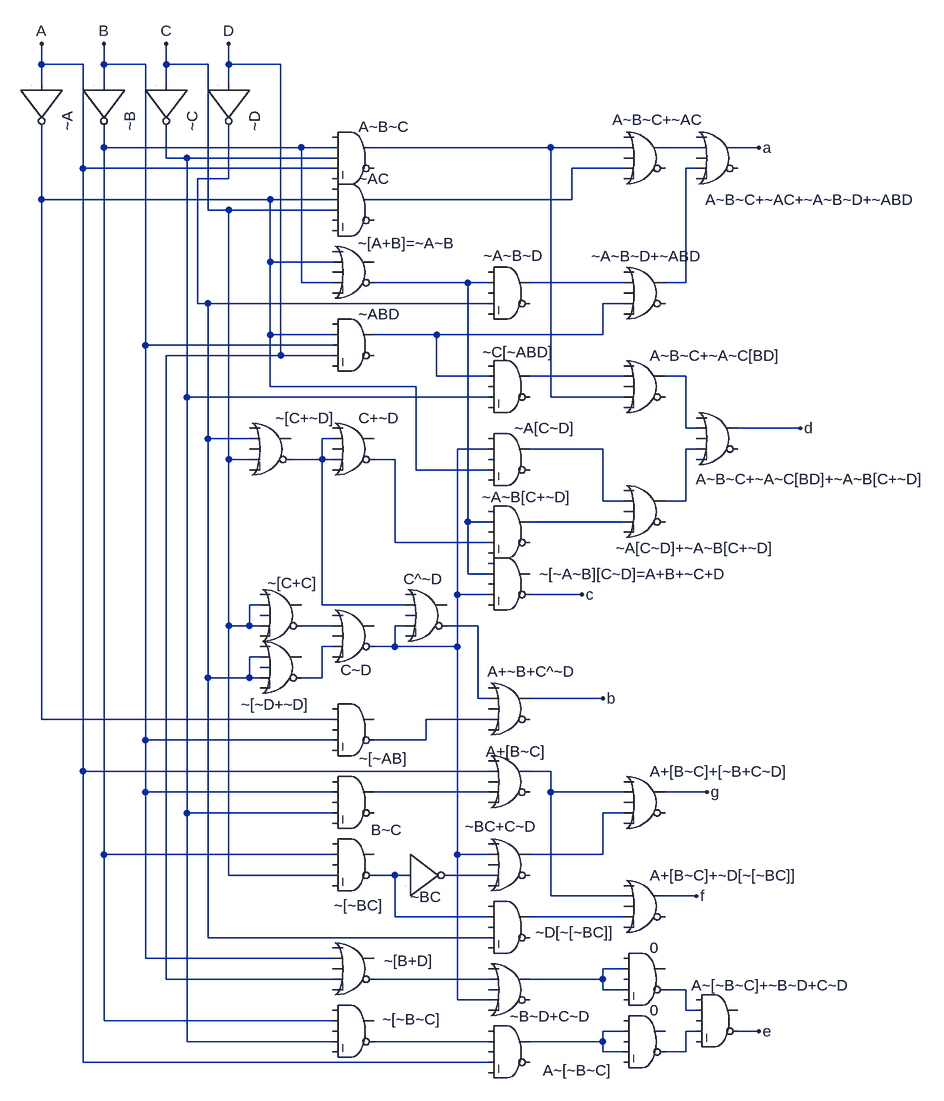
[diagram p0: schematic draft.asc]
draft.asc, the LTspice schematic file:
Version 4
SHEET 1 880 2072
WIRE -1280 -1504 -1280 -1536
WIRE -1216 -1504 -1280 -1504
WIRE -1184 -1504 -1184 -1536
WIRE -1120 -1504 -1184 -1504
WIRE -1088 -1504 -1088 -1536
WIRE -1024 -1504 -1088 -1504
WIRE -992 -1504 -992 -1536
WIRE -912 -1504 -992 -1504
WIRE -1280 -1472 -1280 -1504
WIRE -1184 -1472 -1184 -1504
WIRE -1088 -1472 -1088 -1504
WIRE -992 -1472 -992 -1504
WIRE -1184 -1376 -1184 -1408
WIRE -880 -1376 -1184 -1376
WIRE -832 -1376 -880 -1376
WIRE -496 -1376 -768 -1376
WIRE -384 -1376 -496 -1376
WIRE -272 -1376 -320 -1376
WIRE -176 -1376 -208 -1376
WIRE -1088 -1360 -1088 -1408
WIRE -1056 -1360 -1088 -1360
WIRE -832 -1360 -1056 -1360
WIRE -1216 -1344 -1216 -1504
WIRE -832 -1344 -1216 -1344
WIRE -384 -1344 -464 -1344
WIRE -272 -1344 -288 -1344
WIRE -992 -1328 -992 -1408
WIRE -992 -1328 -1040 -1328
WIRE -1280 -1296 -1280 -1408
WIRE -928 -1296 -1280 -1296
WIRE -832 -1296 -928 -1296
WIRE -464 -1296 -464 -1344
WIRE -464 -1296 -768 -1296
WIRE -1024 -1280 -1024 -1504
WIRE -992 -1280 -1024 -1280
WIRE -832 -1280 -992 -1280
WIRE -928 -1200 -928 -1296
WIRE -832 -1200 -928 -1200
WIRE -880 -1168 -880 -1376
WIRE -832 -1168 -880 -1168
WIRE -624 -1168 -768 -1168
WIRE -592 -1168 -624 -1168
WIRE -384 -1168 -528 -1168
WIRE -288 -1168 -288 -1344
WIRE -288 -1168 -320 -1168
WIRE -1040 -1136 -1040 -1328
WIRE -1024 -1136 -1040 -1136
WIRE -592 -1136 -1024 -1136
WIRE -384 -1136 -416 -1136
WIRE -928 -1088 -928 -1200
WIRE -832 -1088 -928 -1088
WIRE -672 -1088 -768 -1088
WIRE -416 -1088 -416 -1136
WIRE -416 -1088 -672 -1088
WIRE -1120 -1072 -1120 -1504
WIRE -832 -1072 -1120 -1072
WIRE -912 -1056 -912 -1504
WIRE -912 -1056 -1088 -1056
WIRE -832 -1056 -912 -1056
WIRE -672 -1024 -672 -1088
WIRE -592 -1024 -672 -1024
WIRE -384 -1024 -528 -1024
WIRE -288 -1024 -320 -1024
WIRE -928 -1008 -928 -1088
WIRE -704 -1008 -928 -1008
WIRE -1056 -992 -1056 -1360
WIRE -592 -992 -1056 -992
WIRE -496 -992 -496 -1376
WIRE -384 -992 -496 -992
WIRE -288 -944 -288 -1024
WIRE -272 -944 -288 -944
WIRE -112 -944 -208 -944
WIRE -1024 -928 -1024 -1136
WIRE -960 -928 -1024 -928
WIRE -832 -928 -848 -928
WIRE -592 -912 -640 -912
WIRE -416 -912 -528 -912
WIRE -272 -912 -288 -912
WIRE -992 -896 -992 -1280
WIRE -960 -896 -992 -896
WIRE -848 -896 -848 -928
WIRE -848 -896 -896 -896
WIRE -832 -896 -848 -896
WIRE -736 -896 -768 -896
WIRE -704 -880 -704 -1008
WIRE -592 -880 -704 -880
WIRE -416 -832 -416 -912
WIRE -384 -832 -416 -832
WIRE -288 -832 -288 -912
WIRE -288 -832 -320 -832
WIRE -624 -800 -624 -1168
WIRE -592 -800 -624 -800
WIRE -384 -800 -528 -800
WIRE -736 -768 -736 -896
WIRE -592 -768 -736 -768
WIRE -624 -720 -624 -800
WIRE -592 -720 -624 -720
WIRE -640 -688 -640 -912
WIRE -592 -688 -640 -688
WIRE -448 -688 -528 -688
WIRE -944 -672 -960 -672
WIRE -848 -672 -848 -896
WIRE -720 -672 -848 -672
WIRE -992 -640 -992 -896
WIRE -960 -640 -960 -672
WIRE -960 -640 -992 -640
WIRE -944 -640 -960 -640
WIRE -832 -640 -880 -640
WIRE -720 -640 -736 -640
WIRE -608 -640 -656 -640
WIRE -832 -608 -848 -608
WIRE -736 -608 -736 -640
WIRE -736 -608 -768 -608
WIRE -640 -608 -640 -688
WIRE -640 -608 -736 -608
WIRE -944 -592 -960 -592
WIRE -1024 -560 -1024 -928
WIRE -960 -560 -960 -592
WIRE -960 -560 -1024 -560
WIRE -944 -560 -960 -560
WIRE -848 -560 -848 -608
WIRE -848 -560 -880 -560
WIRE -608 -528 -608 -640
WIRE -592 -528 -608 -528
WIRE -416 -528 -528 -528
WIRE -1280 -496 -1280 -1296
WIRE -832 -496 -1280 -496
WIRE -592 -496 -688 -496
WIRE -1120 -464 -1120 -1072
WIRE -832 -464 -1120 -464
WIRE -688 -464 -688 -496
WIRE -688 -464 -768 -464
WIRE -1216 -416 -1216 -1344
WIRE -592 -416 -1216 -416
WIRE -496 -416 -528 -416
WIRE -1120 -384 -1120 -464
WIRE -832 -384 -1120 -384
WIRE -592 -384 -768 -384
WIRE -496 -384 -496 -416
WIRE -384 -384 -496 -384
WIRE -256 -384 -320 -384
WIRE -1056 -352 -1056 -992
WIRE -832 -352 -1056 -352
WIRE -384 -352 -416 -352
WIRE -1184 -288 -1184 -1376
WIRE -832 -288 -1184 -288
WIRE -640 -288 -640 -608
WIRE -592 -288 -640 -288
WIRE -416 -288 -416 -352
WIRE -416 -288 -528 -288
WIRE -992 -256 -992 -640
WIRE -832 -256 -992 -256
WIRE -736 -256 -768 -256
WIRE -720 -256 -736 -256
WIRE -592 -256 -656 -256
WIRE -496 -224 -496 -384
WIRE -384 -224 -496 -224
WIRE -272 -224 -320 -224
WIRE -736 -192 -736 -256
WIRE -592 -192 -736 -192
WIRE -384 -192 -528 -192
WIRE -1024 -160 -1024 -560
WIRE -592 -160 -1024 -160
WIRE -1120 -128 -1120 -384
WIRE -832 -128 -1120 -128
WIRE -384 -112 -416 -112
WIRE -1088 -96 -1088 -1056
WIRE -832 -96 -1088 -96
WIRE -592 -96 -768 -96
WIRE -416 -96 -416 -112
WIRE -416 -96 -528 -96
WIRE -416 -80 -416 -96
WIRE -384 -80 -416 -80
WIRE -288 -80 -320 -80
WIRE -640 -64 -640 -288
WIRE -592 -64 -640 -64
WIRE -288 -48 -288 -80
WIRE -272 -48 -288 -48
WIRE -1184 -32 -1184 -288
WIRE -832 -32 -1184 -32
WIRE -384 -16 -416 -16
WIRE -272 -16 -288 -16
WIRE -176 -16 -208 -16
WIRE -1056 0 -1056 -352
WIRE -832 0 -1056 0
WIRE -592 0 -768 0
WIRE -416 0 -416 -16
WIRE -416 0 -528 0
WIRE -416 16 -416 0
WIRE -384 16 -416 16
WIRE -288 16 -288 -16
WIRE -288 16 -320 16
WIRE -1216 32 -1216 -416
WIRE -592 32 -1216 32
FLAG -1280 -1536 A
FLAG -1184 -1536 B
FLAG -1088 -1536 C
FLAG -992 -1536 D
FLAG -176 -1376 a
FLAG -112 -944 d
FLAG -448 -688 c
FLAG -416 -528 b
FLAG -256 -384 g
FLAG -272 -224 f
FLAG -176 -16 e
SYMBOL Digital\\and -800 -1344 R0
SYMATTR InstName ~AC
SYMBOL Digital\\and -800 -1136 R0
SYMATTR InstName ~ABD
SYMBOL Digital\\inv -1024 -1472 R90
SYMATTR InstName ~C
SYMBOL Digital\\inv -1216 -1472 R90
SYMATTR InstName ~A
SYMBOL Digital\\inv -1120 -1472 R90
SYMATTR InstName ~B
SYMBOL Digital\\inv -928 -1472 R90
SYMATTR InstName ~D
SYMBOL Digital\\and -800 -1424 R0
SYMATTR InstName A~B~C
SYMBOL Digital\\and -560 -1216 R0
WINDOW 0 -40 6 Left 2
SYMATTR InstName ~A~B~D
SYMBOL Digital\\and -560 -1072 R0
WINDOW 0 -41 11 Left 2
SYMATTR InstName ~C[~ABD]
SYMBOL Digital\\or -352 -1424 R0
WINDOW 0 -49 5 Left 2
SYMATTR InstName A~B~C+~AC
SYMBOL Digital\\or -352 -1216 R0
WINDOW 0 -82 7 Left 2
SYMATTR InstName ~A~B~D+~ABD
SYMBOL Digital\\or -240 -1424 R0
WINDOW 0 -18 128 Left 2
SYMATTR InstName A~B~C+~AC+~A~B~D+~ABD
SYMBOL Digital\\and -560 -960 R0
SYMATTR InstName ~A[C~D]
SYMBOL Digital\\or -928 -976 R0
SYMATTR InstName ~[C+~D]
SYMBOL Digital\\and -560 -848 R0
WINDOW 0 -42 10 Left 2
SYMATTR InstName ~A~B[C+~D]
SYMBOL Digital\\or -352 -1072 R0
SYMATTR InstName A~B~C+~A~C[BD]
SYMBOL Digital\\or -352 -880 R0
WINDOW 0 -44 120 Left 2
SYMATTR InstName ~A[C~D]+~A~B[C+~D]
SYMBOL Digital\\or -240 -992 R0
WINDOW 0 -33 126 Left 2
SYMATTR InstName A~B~C+~A~C[BD]+~A~B[C+~D]
SYMBOL Digital\\or -800 -1248 R0
WINDOW 0 7 19 Left 2
SYMATTR InstName ~[A+B]=~A~B
SYMBOL Digital\\and -560 -768 R0
WINDOW 0 46 48 Left 2
SYMATTR InstName ~[~A~B][C~D]=A+B+~C+D
SYMBOL Digital\\or -560 -576 R0
WINDOW 0 -34 6 Left 2
SYMATTR InstName A+~B+C^~D
SYMBOL Digital\\and -800 -544 R0
WINDOW 0 9 108 Left 2
SYMATTR InstName ~[~AB]
SYMBOL Digital\\or -560 -464 R0
WINDOW 0 -36 17 Left 2
SYMATTR InstName A+[B~C]
SYMBOL Digital\\or -352 -432 R0
SYMATTR InstName A+[B~C]+[~B+C~D]
SYMBOL Digital\\and -800 -432 R0
WINDOW 0 27 106 Left 2
SYMATTR InstName B~C
SYMBOL Digital\\and -800 -336 R0
WINDOW 0 -30 126 Left 2
SYMATTR InstName ~[~BC]
SYMBOL Digital\\or -560 -336 R0
WINDOW 0 -68 5 Left 2
SYMATTR InstName ~BC+C~D
SYMBOL Digital\\and -560 -240 R0
WINDOW 0 40 72 Left 2
SYMATTR InstName ~D[~[~BC]]
SYMBOL Digital\\inv -720 -320 R0
WINDOW 0 8 97 Left 2
SYMATTR InstName ~BC
SYMBOL Digital\\or -352 -272 R0
SYMATTR InstName A+[B~C]+~D[~[~BC]]
SYMBOL Digital\\or -800 -976 R0
SYMATTR InstName C+~D
SYMBOL Digital\\or -688 -720 R0
WINDOW 0 -35 8 Left 2
SYMATTR InstName C^~D
SYMBOL Digital\\or -912 -720 R0
WINDOW 0 -20 14 Left 2
SYMATTR InstName ~[C+C]
SYMBOL Digital\\or -912 -640 R0
WINDOW 0 -61 121 Left 2
SYMATTR InstName ~[~D+~D]
SYMBOL Digital\\or -800 -688 R0
WINDOW 0 -20 116 Left 2
SYMATTR InstName C~D
SYMBOL Digital\\or -800 -176 R0
WINDOW 0 47 52 Left 2
SYMATTR InstName ~[B+D]
SYMBOL Digital\\or -560 -144 R0
WINDOW 0 1 105 Left 2
SYMATTR InstName ~B~D+C~D
SYMBOL Digital\\and -800 -80 R0
WINDOW 0 45 46 Left 2
SYMATTR InstName ~[~B~C]
SYMBOL Digital\\and -560 -48 R0
WINDOW 0 52 92 Left 2
SYMATTR InstName A~[~B~C]
SYMBOL Digital\\and -352 -64 R0
SYMATTR InstName 0
SYMBOL Digital\\and -352 -160 R0
SYMATTR InstName 0
SYMBOL Digital\\and -240 -96 R0
WINDOW 0 -40 9 Left 2
SYMATTR InstName A~[~B~C]+~B~D+C~D

The netlist it stands for:
* draft.asc
A§~AC 0 N008 C 0 0 0 N005 0 AND
A§~ABD 0 N008 B D 0 0 N011 0 AND
A§~C C 0 0 0 0 N004 0 0 BUF
A§~A A 0 0 0 0 N008 0 0 BUF
A§~B B 0 0 0 0 N001 0 0 BUF
A§~D D 0 0 0 0 N007 0 0 BUF
A~B~C 0 N001 N004 A 0 0 N002 0 AND
A§~A~B~D 0 N009 0 N007 0 0 N010 0 AND
A§~C[~ABD] 0 N011 0 N004 0 0 N012 0 AND
A~B~C+~AC 0 N002 0 N005 0 0 N003 0 OR
A§~A~B~D+~ABD 0 N010 0 N011 0 0 N006 0 OR
A~B~C+~AC+~A~B~D+~ABD 0 N003 0 N006 0 0 A 0 OR
A§~A[C~D] 0 N015 0 N008 0 0 N016 0 AND
A§~[C+~D] 0 N007 0 C 0 N014 0 0 OR
A§~A~B[C+~D] 0 N009 0 N018 0 0 N019 0 AND
A~B~C+~A~C[BD] 0 N012 0 N002 0 0 N013 0 OR
A§~A[C~D]+~A~B[C+~D] 0 N016 0 N019 0 0 N017 0 OR
A~B~C+~A~C[BD]+~A~B[C+~D] 0 N013 0 N017 0 0 D 0 OR
A§~[A+B]=~A~B 0 N008 0 N001 0 N009 0 0 OR
A§~[~A~B][C~D]=A+B+~C+D 0 N009 0 N015 0 C 0 0 AND
A+~B+C^~D 0 N021 0 N023 0 0 B 0 OR
A§~[~AB] 0 N008 0 B 0 N023 0 0 AND
A+[B~C] 0 A 0 N025 0 0 N024 0 OR
A+[B~C]+[~B+C~D] 0 N024 0 N026 0 0 g 0 OR
A§B~C 0 B 0 N004 0 0 N025 0 AND
A§~[~BC] 0 N001 0 C 0 N027 0 0 AND
A§~BC+C~D 0 N015 0 N028 0 0 N026 0 OR
A§~D[~[~BC]] 0 N027 0 N007 0 0 N029 0 AND
A§~BC N027 0 0 0 0 N028 0 0 BUF
A+[B~C]+~D[~[~BC]] 0 N024 0 N029 0 0 f 0 OR
A§C+~D 0 N014 0 N014 0 N018 0 0 OR
A§C^~D 0 N014 0 N015 0 N021 0 0 OR
A§~[C+C] 0 C 0 C 0 N020 0 0 OR
A§~[~D+~D] 0 N007 0 N007 0 N022 0 0 OR
A§C~D 0 N020 0 N022 0 N015 0 0 OR
A§~[B+D] 0 B 0 D 0 N031 0 0 OR
A§~B~D+C~D 0 N031 0 N015 0 0 N030 0 OR
A§~[~B~C] 0 N001 0 N004 0 N035 0 0 AND
A~[~B~C] 0 N035 0 A 0 0 N033 0 AND
A§0 0 N033 0 N033 0 N034 0 0 AND
A§0 0 N030 0 N030 0 N032 0 0 AND
A~[~B~C]+~B~D+C~D 0 N032 0 N034 0 e 0 0 AND
.backanno
.end